# Altium schematic sheet Mosfet Driver.SchDoc
size A4
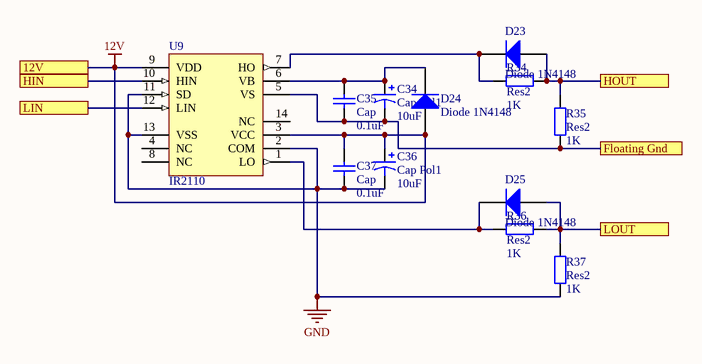
[diagram p0: Mosfet Driver.SchDoc]

## Parts
C34  Cap Pol1  value 10uF  [RB7.6-15]
C35  Cap  value 0.1uF  [RAD-0.3]
C36  Cap Pol1  value 10uF  [RB7.6-15]
C37  Cap  value 0.1uF  [RAD-0.3]
D23  Diode 1N4148  [DO-35]
D24  Diode 1N4148  [DO-35]
D25  Diode 1N4148  [DO-35]
R34  Res2  value 1K  [AXIAL-0.4]
R35  Res2  value 1K  [AXIAL-0.4]
R36  Res2  value 1K  [AXIAL-0.4]
R37  Res2  value 1K  [AXIAL-0.4]
U9  IR2110  [PDIP14]

## Ports
12V, Floating Gnd, HIN, HOUT, LIN, LOUT

## Nets
12V: C36.1 C37.2 D24.1(A) U9.3(VCC) U9.9(VDD) ; port 12V
GND: C36.2 C37.1 R37.2 U9.2(COM) U9.11(SD) U9.13(VSS)
Floating Gnd: C34.2 C35.1 R35.1 U9.5(VS) ; port Floating Gnd
HIN: U9.10(HIN) ; port HIN
HOUT: D23.1(A) R34.2 R35.2 ; port HOUT
LIN: U9.12(LIN) ; port LIN
LOUT: D25.1(A) R36.1 R37.1 ; port LOUT
NetC34_1: C34.1 C35.2 D24.2(K) U9.6(VB)
NetD23_2: D23.2(K) R34.1 U9.7(HO)
NetD25_2: D25.2(K) R36.2 U9.1(LO)

Not connected (* = marked no-connect by the designer): U9 4(NC) 8(NC) 14(NC)

## Library data of the parts
C34 C36 = Cap Pol1: Polarized Capacitor (Radial); Published: 8-Jun-2000; LatestRevisionDate: 17-Jul-2002; LatestRevisionNote: Re-released for DXP Platform.; PackageReference: RB7.6-15; Publisher: Altium Limited; PackageDescription: Polarized Capacitor (Radial); 2 Leads
C35 C37 = Cap: Capacitor; Published: 8-Jun-2000; LatestRevisionDate: 17-Jul-2002; LatestRevisionNote: Re-released for DXP Platform.; PackageReference: RAD-0.3; Publisher: Altium Limited; PackageDescription: Radial Cap, Thru-Hole; 2 Leads; 0.3 in Pin Spacing
D23-D25 = Diode 1N4148: High Conductance Fast Diode; Published: 8-Jun-2000; LatestRevisionDate: 17-Jul-2002; LatestRevisionNote: Re-released for DXP Platform.; DatasheetVersion: 1997; PackageReference: DO-35; Publisher: Altium Limited; PackageDescription: Diode, Axial; Body 3.8 x 1.9 mm (LxDia. max), Lead Dia. 0.53 mm (max); Code_JEDEC: DO-204-AH; ComponentLink1Description: Manufacturer Link; ComponentLink1URL: http://www.fairchildsemi.com/; ComponentLink2Description: Datasheet; ComponentLink2URL: http://www.fairchildsemi.com/ds/1N%2F1N4148.pdf
R34-R37 = Res2: Resistor; Published: 8-Jun-2000; LatestRevisionDate: 17-Jul-2002; LatestRevisionNote: Re-released for DXP Platform.; PackageReference: AXIAL-0.4; Publisher: Altium Limited; PackageDescription: Axial Device, Thru-Hole; 2 Leads; 0.4 in Pin Spacing
U9 = IR2110: High and Low Side Driver; Note: Pins 4, 8 and 14 are not connected; Published: 8-Jun-2000; LatestRevisionDate: 04-Mar-2005; LatestRevisionNote: Stylized 3D Model Added.; DatasheetVersion: PD60147J; PackageReference: PDIP14; Publisher: Altium Limited; PackageDescription: DIP; 14 Leads; Row Spacing 7.62 mm; Pitch 2.54 mm; ComponentLink1Description: Manufacturer Link; ComponentLink1URL: http://www.irf.com/; ComponentLink2Description: Datasheet; ComponentLink2URL: http://www.irf.com/product-info/datasheets/data/ir2110.pdf